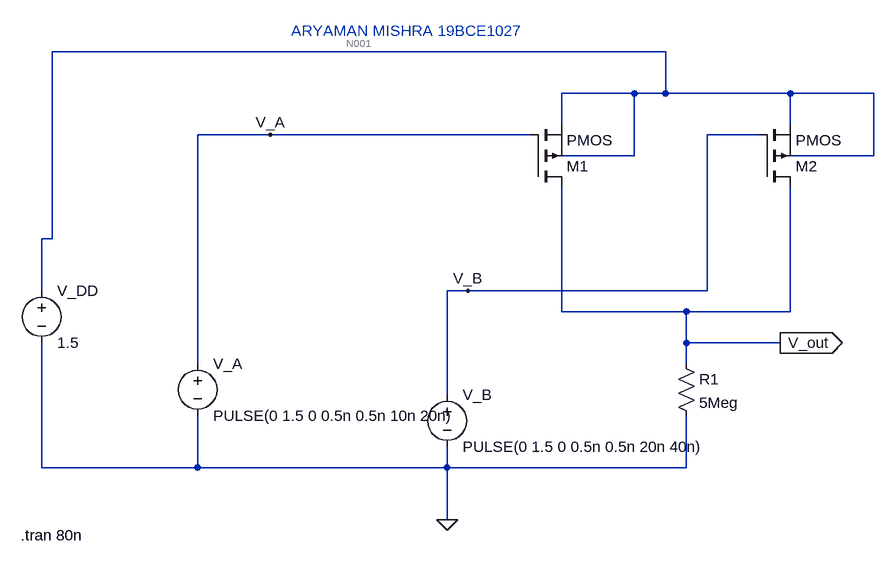
[diagram p0: schematic task7_22.asc]
task7_22.asc, the LTspice schematic file:
Version 4
SHEET 1 880 680
WIRE 528 -96 -416 -96
WIRE 480 -32 368 -32
WIRE 528 -32 528 -96
WIRE 528 -32 480 -32
WIRE 720 -32 528 -32
WIRE 848 -32 720 -32
WIRE 368 16 368 -32
WIRE 720 16 720 -32
WIRE -80 32 -192 32
WIRE 320 32 -80 32
WIRE 672 32 592 32
WIRE 480 64 480 -32
WIRE 480 64 368 64
WIRE 848 64 848 -32
WIRE 848 64 720 64
WIRE -416 192 -416 -96
WIRE -416 192 -432 192
WIRE -432 272 -432 192
WIRE 224 272 192 272
WIRE 592 272 592 32
WIRE 592 272 224 272
WIRE 368 304 368 112
WIRE 560 304 368 304
WIRE 720 304 720 112
WIRE 720 304 560 304
WIRE 560 352 560 304
WIRE 704 352 560 352
WIRE -192 384 -192 32
WIRE 560 384 560 352
WIRE 192 432 192 272
WIRE -432 544 -432 352
WIRE -192 544 -192 464
WIRE -192 544 -432 544
WIRE 192 544 192 512
WIRE 192 544 -192 544
WIRE 560 544 560 464
WIRE 560 544 192 544
WIRE 192 624 192 544
FLAG -80 32 V_A
FLAG 224 272 V_B
FLAG 192 624 0
FLAG 704 352 V_out
IOPIN 704 352 Out
SYMBOL pmos 320 112 M180
SYMATTR InstName M1
SYMBOL pmos 672 112 M180
SYMATTR InstName M2
SYMBOL res 544 368 R0
SYMATTR InstName R1
SYMATTR Value 5Meg
SYMBOL voltage -432 256 R0
WINDOW 123 0 0 Left 0
WINDOW 39 0 0 Left 0
SYMATTR InstName V_DD
SYMATTR Value 1.5
SYMBOL voltage -192 368 R0
WINDOW 123 0 0 Left 0
WINDOW 39 0 0 Left 0
SYMATTR InstName V_A
SYMATTR Value PULSE(0 1.5 0 0.5n 0.5n 10n 20n)
SYMBOL voltage 192 416 R0
WINDOW 123 0 0 Left 0
WINDOW 39 0 0 Left 0
SYMATTR InstName V_B
SYMATTR Value PULSE(0 1.5 0 0.5n 0.5n 20n 40n)
TEXT -464 648 Left 2 !.tran 80n
TEXT -48 -128 Left 2 ;ARYAMAN MISHRA 19BCE1027

The netlist it stands for:
* task7_22.asc
M1 V_out V_A N001 N001 PMOS
M2 V_out V_B N001 N001 PMOS
R1 V_out 0 5Meg
V_DD N001 0 1.5
V_A V_A 0 PULSE(0 1.5 0 0.5n 0.5n 10n 20n)
V_B V_B 0 PULSE(0 1.5 0 0.5n 0.5n 20n 40n)
.model NMOS NMOS
.model PMOS PMOS
.lib standard.mos
.tran 80n
* ARYAMAN MISHRA 19BCE1027
.backanno
.end

* Results of the author's LTspice run, read from the files saved beside the schematic
* Operating Point, zero values left out:
*   V(v_out) = 1.495 V
*   V(n001) = 1.5 V
*   Id(M2) = -149.5 nA
*   Is(M2) = 149.5 nA
*   Id(M1) = -149.5 nA
*   Is(M1) = 149.5 nA
*   I(R1) = 299 nA
*   I(V_dd) = -299 nA
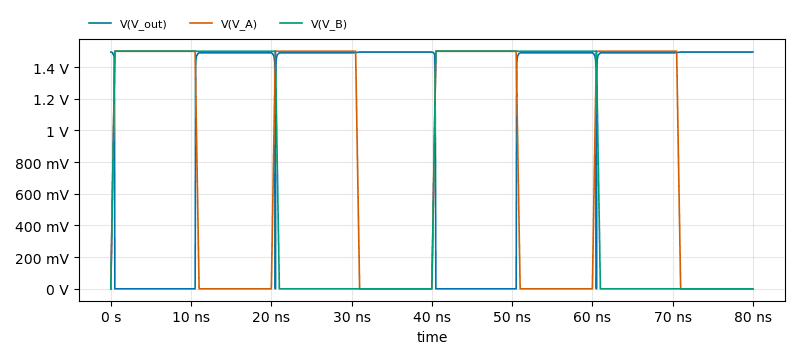
[diagram p1: Transient Analysis of task7_22.asc, plotted from the saved traces]
* Transient Analysis, 1 run:
*   V(V_out): min 30.1 µV, max 1.495 V, average 1.112 V, rms 1.287 V, last 1.495 V
*   V(V_A): min 0 V, max 1.5 V, average 787.5 mV, rms 1.079 V, last 0 V
*   V(V_B): min 0 V, max 1.5 V, average 768.7 mV, rms 1.07 V, last 0 V